# EAGLE design EMP11 (EAGLE 6.6.0)
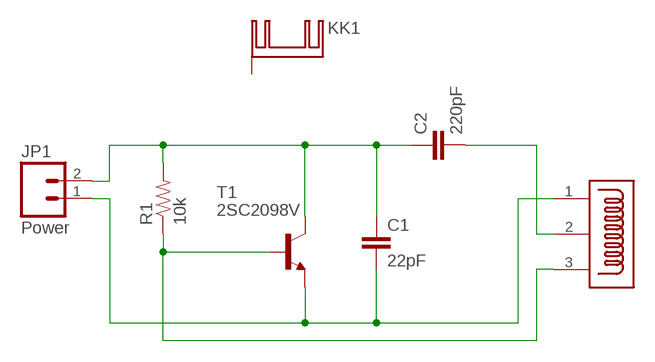
[diagram p0: schematic, sheet 1]

## Parts
C1  22pF  CAPPTH  [CAP-PTH-SMALL]
C2  220pF  CAPPTH  [CAP-PTH-SMALL]
JP1  Power  M02PTH  [1X02]
KK1  D03PA-PAD  [D03PA-PAD]
R1  10k  RESISTORPTH-1/4W  [AXIAL-0.4]
T1  2SC2098V  [TO220AV]
U$1  EMP_WIRE  [EMP_WIRE]

## Nets
27V: C1.1 C2.1 JP1.2 R1.P$2 T1.2(C)
GND: C1.2 JP1.1 T1.3(E) U$1.1
N$3: R1.P$1 T1.1(B) U$1.3
N$4: C2.2 U$1.2
Unconnected: KK1.B(K)

## Library data of the parts
C1 C2 = SparkFun-Capacitors:CAP: Capacitor Standard 0603 ceramic capacitor, and 0.1" leaded capacitor.
JP1 = SparkFun-Connectors:M02: Standard 2-pin 0.1" header. Use with - straight break away headers ( PRT-00116) - right angle break away headers (PRT-00553) - swiss pins (PRT-00743) - machine pins (PRT-00117) - female headers (PRT-00115) Molex polarized connector foot print use with: PRT-08233 with associated crimp pins and housings. 2.54_SCREWTERM for use with PRT-10571. 3.5mm Screw Terminal footprints for PRT-08084 5mm Screw Terminal footprints for use with PRT-08433
KK1 = heatsink:D03PA-PAD: HEATSINK distributor Schukat
R1 = SparkFun-Resistors:RESISTOR: Resistor Basic schematic elements and footprints for 0603, 1206, and PTH resistors.
T1 = transistor:2SC2098: NPN Epitaxial Planar Transistor RF Power Amplivier Source: 2SC2098.pdf
U$1 = emp:EMP_WIRE

## Board
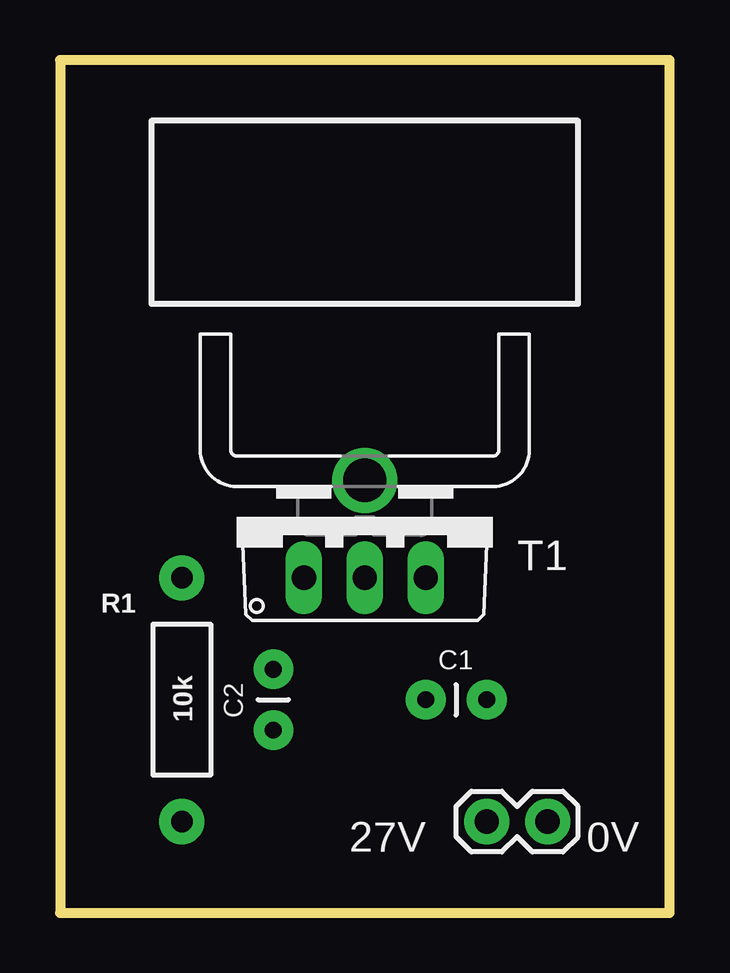
[diagram p1: board, top side]
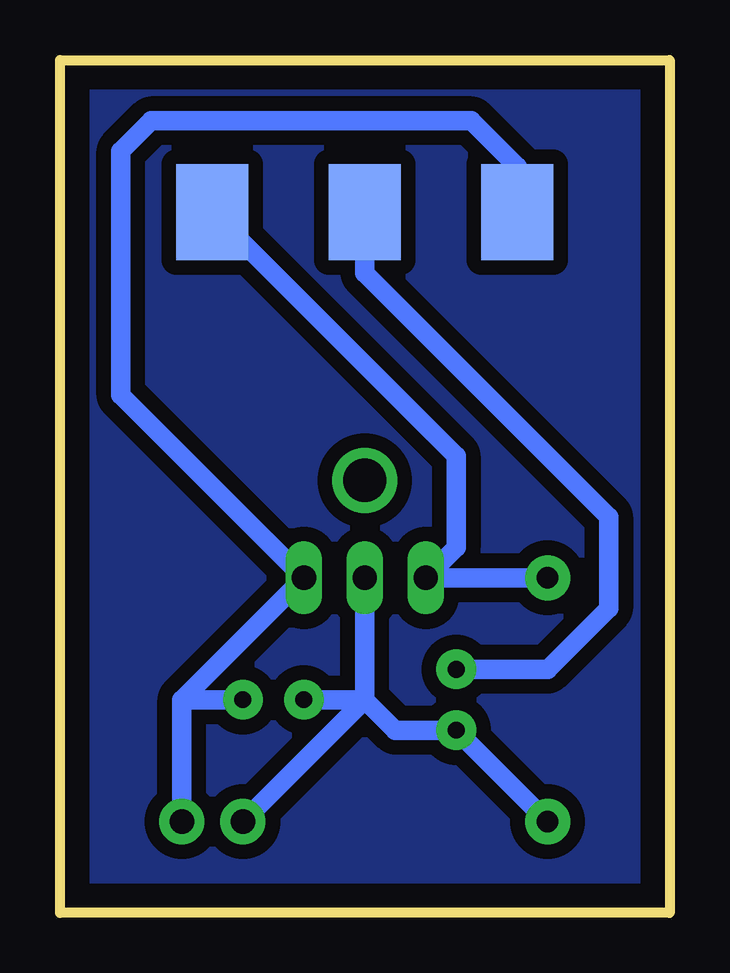
[diagram p2: board, bottom side, seen from below]

Size 25.4 x 35.56 mm. Coordinates in mm from the lower left corner, seen from the top.
Outline: 0,0 25.4,0 25.4,35.56 0,35.56 0,0
Copper layers (1*16): Top 0.035mm / dielectric 1.5mm / Bottom 0.035mm
Design rules "default": minimum track width 10mil, minimum drill 24mil, track to track 8mil, track to pad 8mil, pad to pad 8mil, via to via 8mil, smd to smd 8mil, copper to edge 40mil, drill to drill 8mil, minimum pad ring 10mil, minimum via ring 8mil, stop-mask expansion 4mil, vias tented up to drill 0mil, thermal gap 10mil

### Footprints (pad centres in the part's own frame; a part is rotated, then mirrored left to right if it is on the bottom)
CAP-PTH-SMALL = drill 0.7 pad 1.651: 1 0,0; 2 2.54,0
1X02 = drill 1.016 pad 1.88: 1 0,0; 2 2.54,0
D03PA-PAD = drill 1.803 pad 2.54: B 0,-1.016
AXIAL-0.4 = drill 0.9 pad 1.88: P$1 -5.08,0; P$2 5.08,0
TO220AV = drill 1.016 long: 1 -2.54,-2.54; 2 0,-2.54; 3 2.54,-2.54
EMP_WIRE = smd 4 x 3 bottom: 1 0,6.35; 2 0,0; 3 0,-6.35

### Placement (x,y rotation side)
C1  15.24,8.89 0 top
C2  8.89,7.62 90 top
JP1  20.32,3.81 180 top
KK1  12.7,19.05 0 top
R1  5.08,8.89 270 top
T1  12.7,16.51 0 top
U$1  12.7,29.21 90 top

### Tracks (layer width: path | path; a pad name or v marks a point on that pad's centre or on a via)
27V
  Bottom 0.813: JP1.2 12.7,8.89 | 12.7,8.89 T1.2 | C1.1 12.7,8.89 | 12.7,8.89 11.43,7.62 C2.1 R1.P$2
GND
  Bottom 0.813: JP1.1 20.32,8.89 | 20.32,8.89 T1.3 22.86,21.59 22.86,31.75 21.59,33.02 8.26,33.02 6.35,31.11 U$1.1 | C1.2 20.32,8.89
N$1
  pour Bottom (isolate 0.61): 0,35.56 25.4,35.56 25.4,0 0,0
N$3
  Bottom 0.813: R1.P$1 T1.1 8.89,15.24 8.89,19.05 U$1.3
N$4
  Bottom 0.813: C2.2 5.08,10.16 2.54,12.7 2.54,16.51 12.7,26.67 U$1.2

### Text on the board
tPlace: 27V | 0V